# Altium schematic sheet main.SchDoc
size A
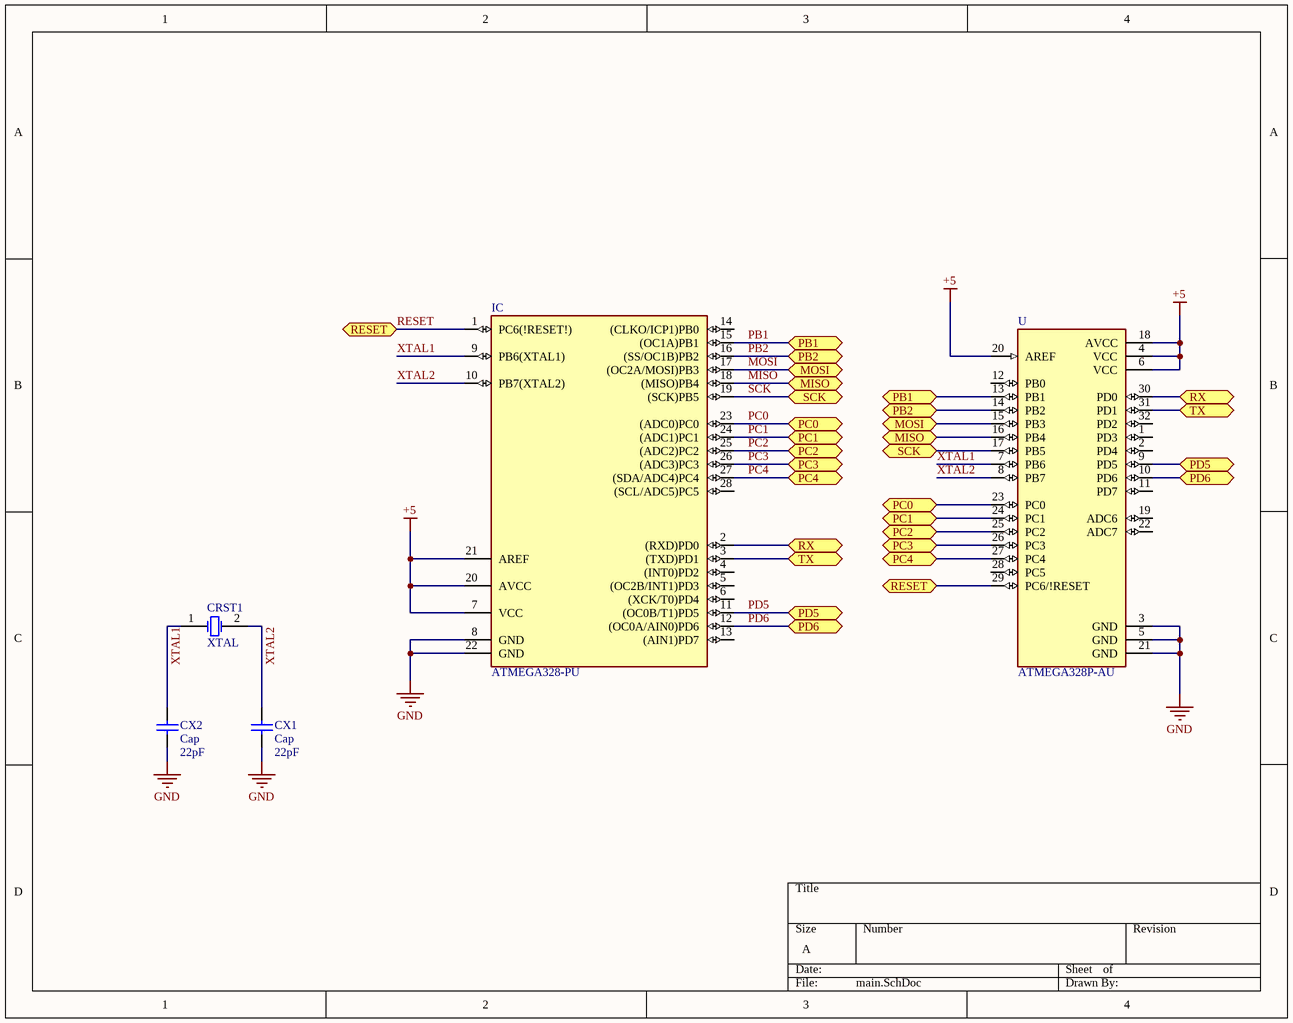
[diagram p0: main.SchDoc]

## Parts
CRST1  XTAL  [R38]
CX1  Cap  value 22pF  [RAD-0.3]
CX2  Cap  value 22pF  [RAD-0.3]
IC  ATMEGA328-PU  [DIL28]
U  ATMEGA328P-AU  [QFP80P900X900X120-32N]

## Ports
MISO (bidir), MOSI (bidir), PB1 (bidir), PB2 (bidir), PC0 (bidir), PC1 (bidir), PC2 (bidir), PC3 (bidir), PC4 (bidir), PD5 (bidir), PD6 (bidir), RESET (bidir), RX (bidir), SCK (bidir), TX (bidir)

## Nets
+5: IC.7(VCC) IC.20(AVCC) IC.21(AREF) U.4(VCC) U.6(VCC) U.18(AVCC) U.20(AREF)
GND: CX1.2 CX2.2 IC.8(GND) IC.22(GND) U.3(GND) U.5(GND) U.21(GND)
MISO: IC.18((MISO)PB4) U.16(PB4) ; port MISO
MOSI: IC.17((OC2A/MOSI)PB3) U.15(PB3) ; port MOSI
PB1: IC.15((OC1A)PB1) U.13(PB1) ; port PB1
PB2: IC.16((SS/OC1B)PB2) U.14(PB2) ; port PB2
PC0: IC.23((ADC0)PC0) U.23(PC0) ; port PC0
PC1: IC.24((ADC1)PC1) U.24(PC1) ; port PC1
PC2: IC.25((ADC2)PC2) U.25(PC2) ; port PC2
PC3: IC.26((ADC3)PC3) U.26(PC3) ; port PC3
PC4: IC.27((SDA/ADC4)PC4) U.27(PC4) ; port PC4
PD5: IC.11((OC0B/T1)PD5) U.9(PD5) ; port PD5
PD6: IC.12((OC0A/AIN0)PD6) U.10(PD6) ; port PD6
RESET: IC.1(PC6(!RESET!)) U.29(PC6/!RESET) ; port RESET
RX: IC.2((RXD)PD0) U.30(PD0) ; port RX
SCK: IC.19((SCK)PB5) U.17(PB5) ; port SCK
TX: IC.3((TXD)PD1) U.31(PD1) ; port TX
XTAL1: CRST1.1(OSC1) CX2.1 IC.9(PB6(XTAL1)) U.7(PB6)
XTAL2: CRST1.2(OSC2) CX1.1 IC.10(PB7(XTAL2)) U.8(PB7)

Not connected (* = marked no-connect by the designer): IC 4((INT0)PD2) 5((OC2B/INT1)PD3) 6((XCK/T0)PD4) 13((AIN1)PD7) 14((CLKO/ICP1)PB0) 28((SCL/ADC5)PC5); U 1(PD3) 2(PD4) 11(PD7) 12(PB0) 19(ADC6) 22(ADC7) 28(PC5) 32(PD2)

## Library data of the parts
CRST1 = XTAL: Crystal Oscillator; Published: 8-Jun-2000; LatestRevisionDate: 17-Jul-2002; LatestRevisionNote: Re-released for DXP Platform.; PackageReference: R38; Publisher: Altium Limited; PackageDescription: Crystal, Thru-Hole; 2 Leads; Body 3.1 x 8.2 mm (Dia.xH)
CX1 CX2 = Cap: Capacitor; Published: 8-Jun-2000; LatestRevisionDate: 17-Jul-2002; LatestRevisionNote: Re-released for DXP Platform.; PackageReference: RAD-0.3; Publisher: Altium Limited; PackageDescription: Radial Cap, Thru-Hole; 2 Leads; 0.3 in Pin Spacing
IC = ATMEGA328-PU: AVR AVRÂ® ATmega Microcontroller IC 8-Bit 20MHz 32KB _16K x 16_ FLASH 28-PDIP; MF: Microchip Technology; Package: DIP-28 Microchip Technology; Price: None; Availability: Unavailable; MP: ATMEGA328-PU; SnapEDA_Link: https://www.snapeda.com/parts/ATMEGA328-PU/Microchip/view-part/4327846/?ref=snap; Value: *
U = ATMEGA328P-AU: AVR AVRÂ® ATmega Microcontroller IC 8-Bit 20MHz 32KB _16K x 16_ FLASH 32-TQFP _7x7_; MF: Microchip; Value: *; SnapEDA_Link: https://www.snapeda.com/parts/ATMEGA328P-AU/Microchip/view-part/44280/?ref=snap; MP: ATMEGA328P-AU; Availability: Unavailable; Price: None; Package: TQFP-32 Microchip